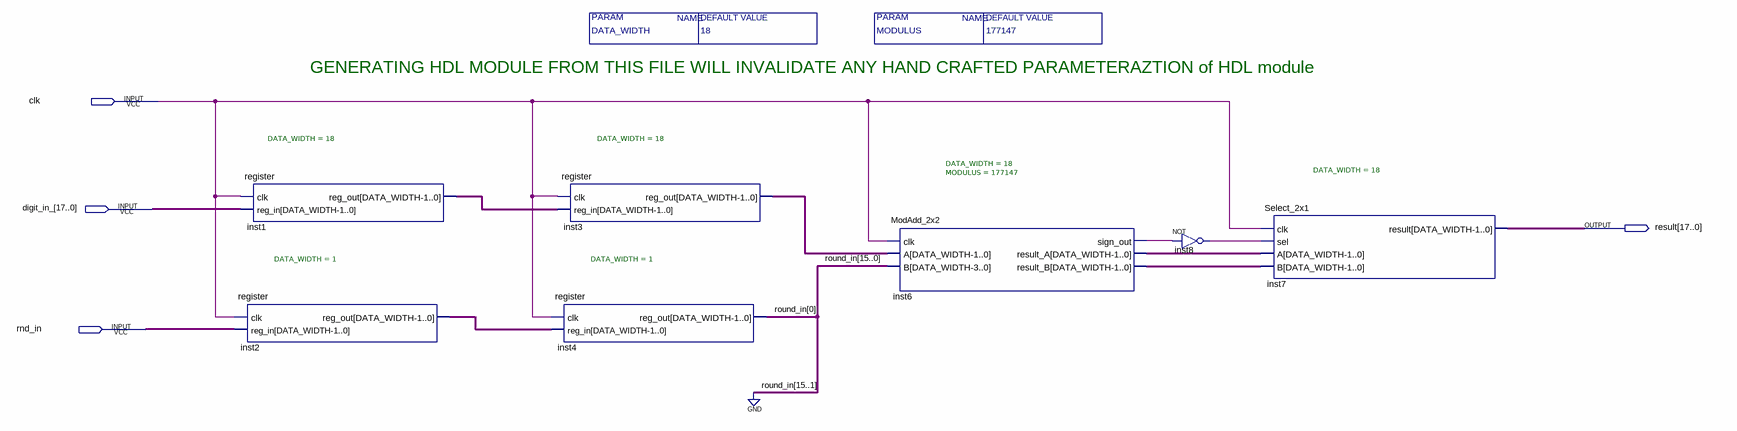
[diagram p0: schematic sheet]
// Quartus schematic ModAddOne_4L.bdf as structural Verilog: 7 symbols, 4 pins
module ModAddOne_4L #(parameter DATA_WIDTH = 18, parameter MODULUS = 177147) (
  input  clk,
  input  [17:0] digit_in_,
  input  rnd_in,
  output [17:0] result
);

  wire inst2_reg_out, inst6_sign_out, inst8_out;
  wire [0:0] round_in;
  wire [17:0] inst1_reg_out, inst3_reg_out, inst6_result_a, inst6_result_b;

  register #(.DATA_WIDTH(18)) inst1 (.clk(clk), .reg_in(digit_in_), .reg_out(inst1_reg_out));
  register #(.DATA_WIDTH(1)) inst2 (.clk(clk), .reg_in(rnd_in), .reg_out(inst2_reg_out));
  register #(.DATA_WIDTH(18)) inst3 (.clk(clk), .reg_in(inst1_reg_out), .reg_out(inst3_reg_out));
  register #(.DATA_WIDTH(1)) inst4 (.clk(clk), .reg_in(inst2_reg_out), .reg_out(round_in[0]));
  ModAdd_2x2 #(.DATA_WIDTH(18), .MODULUS(177147)) inst6 (
    .clk(clk), .A(inst3_reg_out), .B({{15{1'b0}}, round_in[0]}), .sign_out(inst6_sign_out),
    .result_A(inst6_result_a), .result_B(inst6_result_b));
  not inst8 (inst8_out, inst6_sign_out);
  Select_2x1 #(.DATA_WIDTH(18)) inst7 (
    .clk(clk), .sel(inst8_out), .A(inst6_result_a), .B(inst6_result_b), .result(result));

  // Notes on the sheet:
  //   GENERATING HDL MODULE FROM THIS FILE WILL INVALIDATE ANY HAND CRAFTED PARAMETERAZTION of HDL module
endmodule
